# EAGLE schematic fishnet-0.1 (EAGLE 6.2)
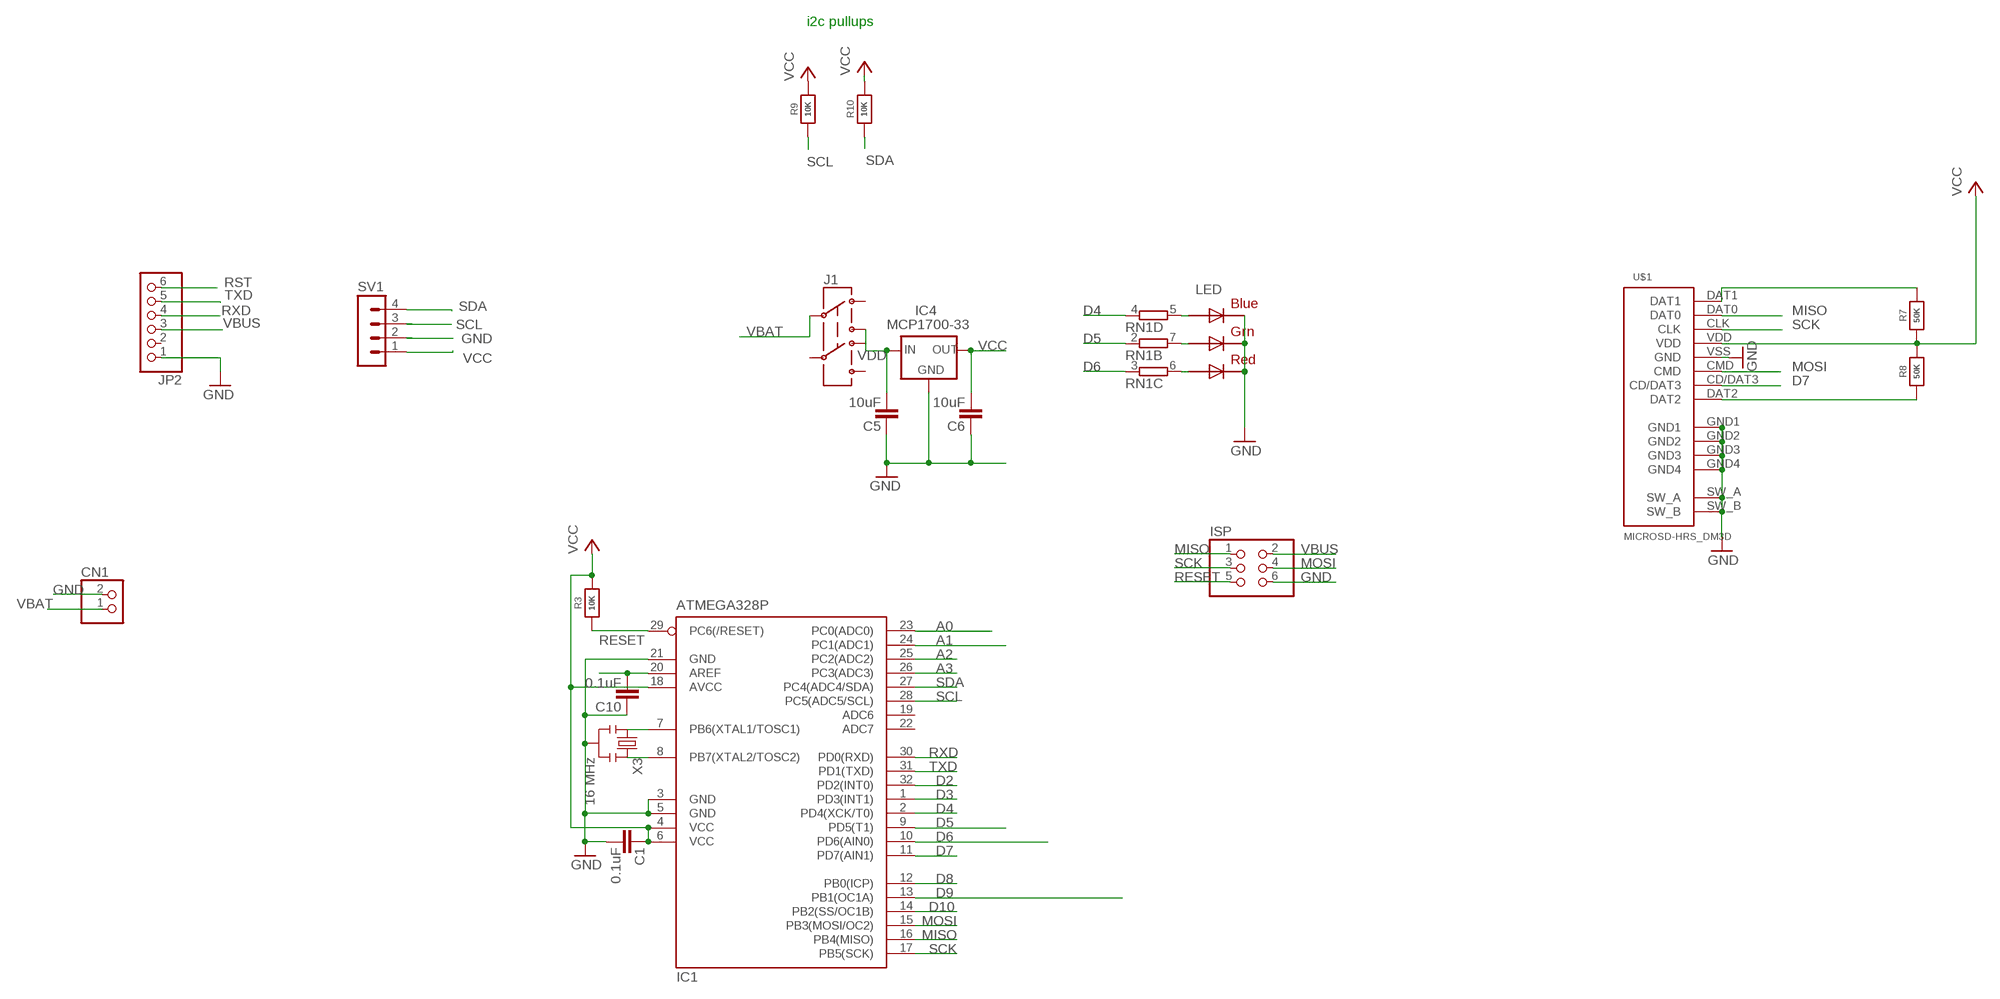
[diagram p0: schematic, sheet 1]

## Parts
C1  0.1uF  CAP0603-CAP  [0603-CAP]
C5  10uF  CAP0603-CAP  [0603-CAP]
C6  10uF  CAP0603-CAP  [0603-CAP]
C10  0.1uF  CAP0603-CAP  [0603-CAP]
CN1  JST_2PIN-SMT-RA  [JST-PH-2-SMT-RA]
IC1  ATMEGA328P  MEGA8-AI  [TQFP32-08]
IC4  MCP1700-33  MCP1700SOT89  [SOT89]
ISP  PINHD-2X3  [2X03]
J1  AYZ0202  [AYZ0202]
JP2  PINHD-1X6  [1X06]
LED  RGBLED5050  [RGBLED5050]
R3  10K  RESISTOR_0603_NOOUT  [0603-NO]
R7  50K  RESISTOR_0603_NOOUT  [0603-NO]
R8  50K  RESISTOR_0603_NOOUT  [0603-NO]
R9  10K  RESISTOR_0603_NOOUT  [0603-NO]
R10  10K  RESISTOR_0603_NOOUT  [0603-NO]
RN1  4R-NEXB38V  [EXB38V]
SV1  MA04-1  [MA04-1]
U$1  MICROSD-HRS_DM3D  [DM3D]
X3  16 MHz  RESONATORSMD  [RESONATOR-SMD]

## Nets
A0: IC1.23(PC0(ADC0))
A1: IC1.24(PC1(ADC1))
A2: IC1.25(PC2(ADC2))
A3: IC1.26(PC3(ADC3))
AREF: C10.1 IC1.20(AREF)
D2: IC1.32(PD2(INT0))
D3: IC1.1(PD3(INT1))
D4: IC1.2(PD4(XCK/T0)) RN1.4
D5: IC1.9(PD5(T1)) RN1.2
D6: IC1.10(PD6(AIN0)) RN1.3
D7: IC1.11(PD7(AIN1)) U$1.CD/DAT3
D8: IC1.12(PB0(ICP))
D9: IC1.13(PB1(OC1A))
D10: IC1.14(PB2(SS/OC1B))
GND: C1.1 C5.2 C6.2 C10.2 CN1.2 IC1.3(GND) IC1.5(GND) IC1.21(GND) IC4.1(GND) ISP.6 JP2.1 LED.4(BLUE_C) LED.5(RED_C) LED.6(GREEN_C) SV1.2 U$1.GND1 U$1.GND2 U$1.GND3 U$1.GND4 U$1.SW_A U$1.SW_B U$1.VSS(GND) X3.2
MISO: IC1.16(PB4(MISO)) ISP.1 U$1.DAT0
MOSI: IC1.15(PB3(MOSI/OC2)) ISP.4 U$1.CMD
N$1: LED.3(BLUE_A) RN1.5
N$2: IC1.7(PB6(XTAL1/TOSC1)) X3.1
N$3: IC1.8(PB7(XTAL2/TOSC2)) X3.3
N$8: LED.1(GREEN_A) RN1.7
N$9: LED.2(RED_A) RN1.6
N$16: R7.2 U$1.DAT1
N$18: R8.1 U$1.DAT2
RESET: IC1.29(PC6(/RESET)) ISP.5 R3.1
RST: JP2.6
RXD: IC1.30(PD0(RXD)) JP2.4
SCK: IC1.17(PB5(SCK)) ISP.3 U$1.CLK
SCL: IC1.28(PC5(ADC5/SCL)) R9.1 SV1.3
SDA: IC1.27(PC4(ADC4/SDA)) R10.1 SV1.4
TXD: IC1.31(PD1(TXD)) JP2.5
VBAT [vcc]: CN1.1 J1.2
VBUS [vcc]: ISP.2 JP2.3
VCC: C1.2 C6.1 IC1.4(VCC) IC1.6(VCC) IC1.18(AVCC) IC4.3(OUT) R3.2 R7.1 R8.2 R9.2 R10.2 SV1.1 U$1.VDD
VDD: C5.1 IC4.2(IN) J1.1
Unconnected: IC1.19(ADC6) IC1.22(ADC7) J1.3 J1.4 J1.5 J1.6 JP2.2 RN1.1 RN1.8

## Notes on the sheet
- i2c pullups

## Library data of the parts
C1 C5 C6 C10 = SparkFun:CAP: Capacitor Standard 0603 ceramic capacitor, and 0.1" leaded capacitor.
CN1 = adafruit:JST_2PIN: JST 2-Pin Connectors of various flavors SMT-RA (S2B-PH-SM4) 4UConnector #17311 SMT (B2B-PH-SM4) THM-RA (S2B-PH) THM (B2B-PH)
IC1 = atmel:MEGA8: MICROCONTROLLER 8 Kbytes FLASH, 1 kbytes SRAM, 512 bytes EEPROM, USART, 6-channel 10 bit ADC, 2-channel 8 bit ADC Pin compatible with Atmega48, ATMega88, ATMega168 Source: avr.lbr; MPN: ATMEGA8-16AU; OC_FARNELL: 9171371; OC_NEWARK: 73M8863
IC4 = adafruit:MCP1700: VOLTAGE REGULATOR
ISP = pinhead:PINHD-2X3: PIN HEADER
J1 = SparkFunNew:AYZ0202: SPDT Slide Switch Simple SMD single-pull double-throw slide switch. Good for less than 350mA power switch, switching UARTs between devices, etc. Spark Fun Electronics SKU : COM-00597
JP2 = pinhead:PINHD-1X6: PIN HEADER
LED = adafruit:RGBLED: For 5050 RGB LEDs, the order of the LEDs may vary from one manufacturer to another!
R3 R7-R10 = microbuilder:RESISTOR: Resistors For new designs, use the packages preceded by an '_' character since they are more reliable: The following footprints should be used on most boards: _0402 - Standard footprint for regular board layouts _0603 - Standard footprint for regular board layouts _0805 - Standard footprint for regular board layouts _1206 - Standard footprint for regular board layouts For extremely tight-pitch boards where space is at a premium, the following 'micro-pitch' footprints can be used (smaller pads, no silkscreen outline, etc.): _0402MP - Micro-pitch footprint for very dense/compact boards _0603MP - Micro-pitch footprint for very dense/compact boards _0805MP - Micro-pitch footprint for very dense/compact boards _1206MP - Micro-pitch footprint for very dense/compact boards
RN1 = resistor-dil:4R-N: Array Chip Resistor Source: RS Component / Phycomp; OC_FARNELL: unknown; OC_NEWARK: unknown
SV1 = con-lstb:MA04-1: PIN HEADER; OC_FARNELL: unknown; OC_NEWARK: unknown
U$1 = hrs_DM3D-SF:MICROSD-HRS_DM3D
X3 = SparkFun:RESONATOR: Resonator Small SMD resonator. This is the itty bitty 10/20MHz resonators with built in caps. CSTCE10M0G55 and CSTCE20M0V53. Footprint has been reviewed closely but hasn't been tested yet.

## Net classes
0 default: width 0.178 mm, clearance 0.178 mm